# Altium schematic sheet ArduinoNano7segSCH.SchDoc
size A; SheetNumber: 1; SheetTotal: 1
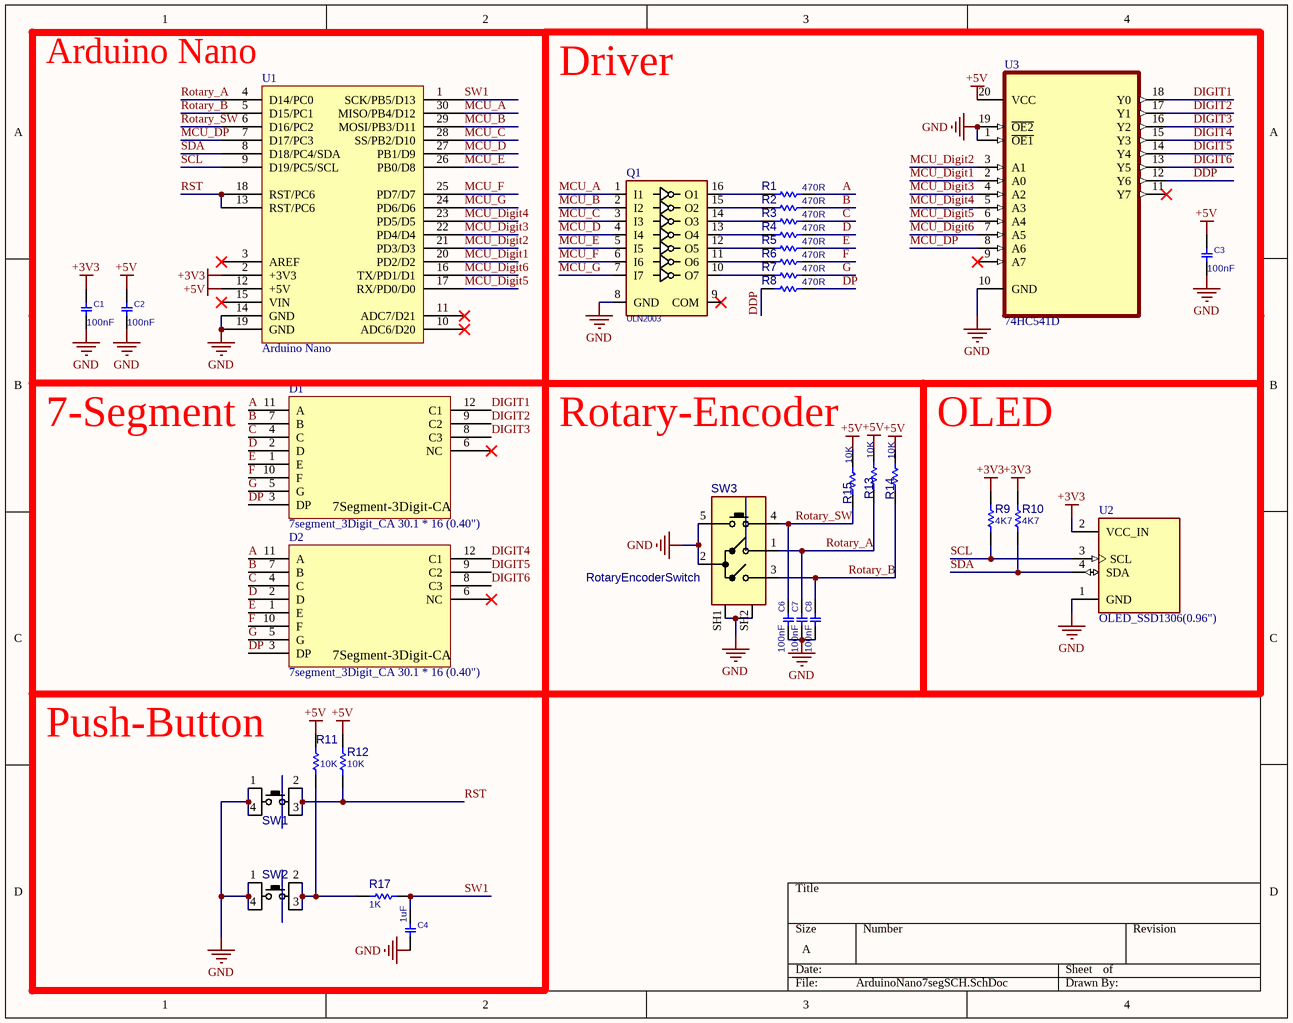
[diagram p0: ArduinoNano7segSCH.SchDoc]

## Parts
C1  100nF  [C0805]
C2  100nF  [C0805]
C3  100nF  [C0805]
C4  1uF  [C0805]
C6  100nF  [C0805]
C7  100nF  [C0805]
C8  100nF  [C0805]
D1  7segment_3Digit_CA 30.1 * 16 (0.40")  [7Seg3Digit]
D2  7segment_3Digit_CA 30.1 * 16 (0.40")  [7Seg3Digit]
Q1  ULN2003  [SO_16]
R1  470R  [R0805]
R2  470R  [R0805]
R3  470R  [R0805]
R4  470R  [R0805]
R5  470R  [R0805]
R6  470R  [R0805]
R7  470R  [R0805]
R8  470R  [R0805]
R9  4K7  [R0805]
R10  4K7  [R0805]
R11  10K  [R0805]
R12  10K  [R0805]
R13  10K  [R0805]
R14  10K  [R0805]
R15  10K  [R0805]
R17  1K  [R0805]
SW1  PUSHBUTTON  [SWPBS_SPDT_6X6X4]  (value not drawn)
SW2  PUSHBUTTON  [SWPBT_SPDT_12X12SKHC]  (value not drawn)
SW3  RotaryEncoderSwitch  [SWROT_11MM]
U1  Arduino Nano  [Arduino Nano]
U2  OLED_SSD1306(0.96")  [OLED_Display 0.96" 64*128]
U3  74HC541D  [74HC541D]

## Nets
+3V3: C1.2 R9.2 R10.2 U1.2(+3V3) U2.2(VCC_IN)
+5V: C2.2 C3.2 R11.2 R12.2 R13.2 R14.2 R15.2 U1.12(+5V) U3.20(VCC)
GND: C1.1 C2.1 C3.1 C4.1 C6.1 C7.1 C8.1 Q1.8(GND) SW1.1(P1) SW1.4(P2) SW2.1(P1) SW2.4(P2) SW3.2(C) SW3.5(D) SW3.SH1 SW3.SH2 U1.14(GND) U1.19(GND) U2.1(GND) U3.1(~{OE1}) U3.10(GND) U3.19(~{OE2})
A: D1.11(A) D2.11(A) R1.1
B: D1.7(B) D2.7(B) R2.1
C: D1.4(C) D2.4(C) R3.1
D: D1.2(D) D2.2(D) R4.1
DDP: R8.2 U3.12(Y6)
DIGIT1: D1.12(C1) U3.18(Y0)
DIGIT2: D1.9(C2) U3.17(Y1)
DIGIT3: D1.8(C3) U3.16(Y2)
DIGIT4: D2.12(C1) U3.15(Y3)
DIGIT5: D2.9(C2) U3.14(Y4)
DIGIT6: D2.8(C3) U3.13(Y5)
DP: D1.3(DP) D2.3(DP) R8.1
E: D1.1(E) D2.1(E) R5.1
F: D1.10(F) D2.10(F) R6.1
G: D1.5(G) D2.5(G) R7.1
MCU_A: Q1.1(I1) U1.30(MISO/PB4/D12)
MCU_B: Q1.2(I2) U1.29(MOSI/PB3/D11)
MCU_C: Q1.3(I3) U1.28(SS/PB2/D10)
MCU_D: Q1.4(I4) U1.27(PB1/D9)
MCU_Digit1: U1.20(PD2/D2) U3.2(A0)
MCU_Digit2: U1.21(PD3/D3) U3.3(A1)
MCU_Digit3: U1.22(PD4/D4) U3.4(A2)
MCU_Digit4: U1.23(PD5/D5) U3.5(A3)
MCU_Digit5: U1.17(RX/PD0/D0) U3.6(A4)
MCU_Digit6: U1.16(TX/PD1/D1) U3.7(A5)
MCU_DP: U1.7(D17/PC3) U3.8(A6)
MCU_E: Q1.5(I5) U1.26(PB0/D8)
MCU_F: Q1.6(I6) U1.25(PD7/D7)
MCU_G: Q1.7(I7) U1.24(PD6/D6)
Rotary_A: C7.2 R13.1 SW3.1(A) U1.4(D14/PC0)
Rotary_B: C8.2 R14.1 SW3.3(B) U1.5(D15/PC1)
Rotary_SW: C6.2 R15.1 SW3.4(E) U1.6(D16/PC2)
RST: R12.1 SW1.2(P3) SW1.3(P4) U1.13(RST/PC6) U1.18(RST/PC6)
SCL: R9.1 U1.9(D19/PC5/SCL) U2.3(SCL)
SDA: R10.1 U1.8(D18/PC4/SDA) U2.4(SDA)
SW1: C4.2 R17.1 U1.1(SCK/PB5/D13)
NetQ1_10: Q1.10(O7) R7.2
NetQ1_11: Q1.11(O6) R6.2
NetQ1_12: Q1.12(O5) R5.2
NetQ1_13: Q1.13(O4) R4.2
NetQ1_14: Q1.14(O3) R3.2
NetQ1_15: Q1.15(O2) R2.2
NetQ1_16: Q1.16(O1) R1.2
NetR11_1: R11.1 R17.2 SW2.2(P3) SW2.3(P4)

Not connected (* = marked no-connect by the designer): D1 6(NC)*; D2 6(NC)*; Q1 9(COM)*; U1 3(AREF)* 10(ADC6/D20)* 11(ADC7/D21)* 15(VIN)*; U3 9(A7)* 11(Y7)*

## Notes on the sheet
- (near U1) Arduino Nano
- Driver
- 7-Segment
- Rotary-Encoder
- OLED
- Push-Button
- (in symbol 7segment_3Digit_CA) 7Segment-3Digit-CA

## Library data of the parts
C1-C4 C6-C8 = CAP_SMD_MLCC_0805: CAP, MLCC; PARAM: -, -%; MANF_P#: MANF_PART#; PARAM2: -V; PRICE: 100= 1$; MANF: -; ASSEMBLY: ASSEMBLY
D1 D2 = 7segment_3Digit_CA
Q1 = ULN2003_SOP16_ST: Darlington, 7-CH, 50V, 0.5A, 5V TTL/CMOS; MANF_P#: ULN2003D1; MANF: ST; PARAM: 7-CH, 50V, 0.5A; PARAM2: 5V TTL/CMOS; VALUE: ULN2003
R1-R15 R17 = RES_SMD_0805: RESISTOR, SMD; PARAM: -W; DESC: DESCRIPTION; DIST#: MOUSER; PARAM2: 1%; MANF_P#: -; MANF: -; ASSEMBLY: ASSEMBLY; PRICE: 100= 0.5$
SW1 = SWPBS_SPDT_6X6X4: SWITCH, PUSH BUTTON, TACTILE, SMD, SPDT, 6X6X4.3mm; MANF: Bond-Tact; DESC: DESCRIPTION; MANF_P#: TS-1143S; VALUE: PUSHBUTTON; ASSEMBLY: ASSEMBLY; PARAM: PARAM; PRICE: PRICE
SW2 = SWPBT_SPDT_12X12_SKHCBEA010: SWITCH, PUSH BUTTON, TACTILE, THD, SPDT, 12X12X7.3mm; MANF: ALPS; DESC: DESCRIPTION; VALUE: PUSHBUTTON; ASSEMBLY: ASSEMBLY; PARAM: PARAM; PRICE: PRICE; MANF_P#: SKHCBEA010
SW3 = SWROT_11MM: SWITCH, ROTARY Encoder, 11mm Metal Shaft; MANF_PART#: RE111F-41B3N-15F-20P; MANF: Alpha; DESC: DESCRIPTION; ASSEMBLY: ASSEMBLY; PARAM: PARAM; PRICE: -; VALUE: RotaryEncoderSwitch
U2 = OLED_Display 0.96" 64*128
U3 = 74HC541D: Buffer, Non-Inverting 1 Element 8 Bit per Element 3-State Output 20-SOIC